# Altium schematic sheet Expansion_Board_DCDC Ver_for_MSP430.SchDoc
size A3
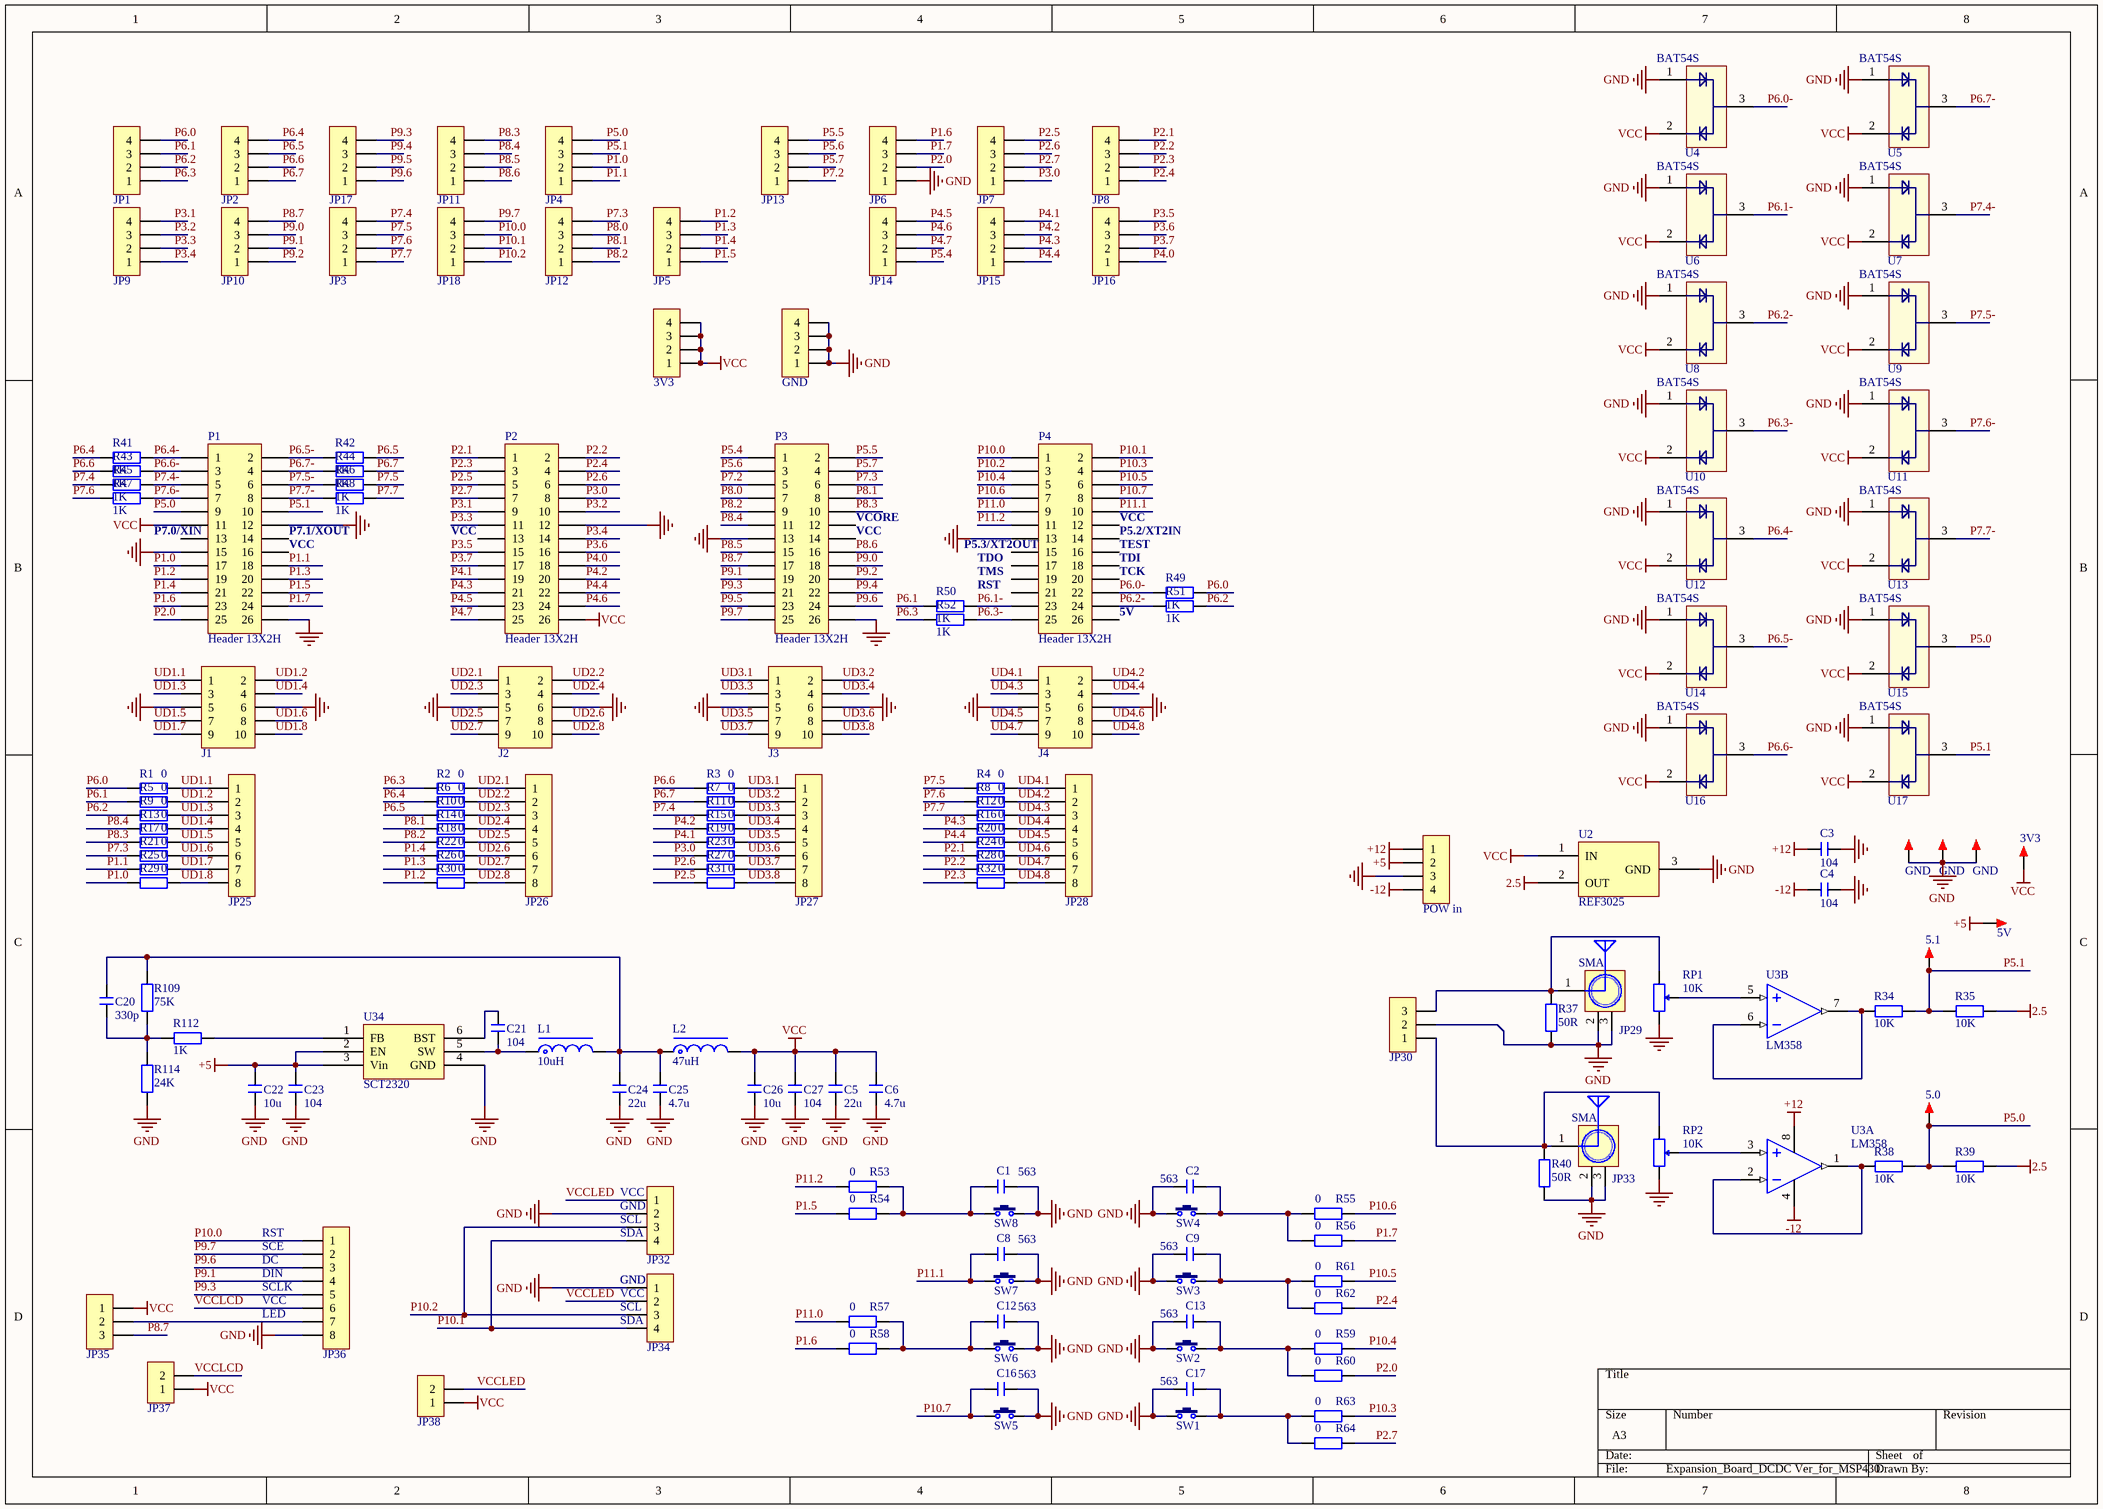
[diagram p0: Expansion_Board_DCDC Ver_for_MSP430.SchDoc]

## Parts
(Parts that share a designator on the sheet are numbered #1, #2 ... from top to bottom, then left to right.)
3V3#1  HDR-1X4  [KF2510-LI-4P]  (value not drawn)
3V3#2  3V3  [TEST 2.0]  (value not drawn)
5.0  3V3  [TEST 2.0]  (value not drawn)
5.1  3V3  [TEST 2.0]  (value not drawn)
5V  3V3  [TEST 2.0]  (value not drawn)
C1  563  [C 0603_L]
C2  563  [C 0603_L]
C3  104  [C 0805_L]
C4  104  [C 0805_L]
C5  22u  [C 1210_L]
C6  4.7u  [C 0805_L]
C8  563  [C 0603_L]
C9  563  [C 0603_L]
C12  563  [C 0603_L]
C13  563  [C 0603_L]
C16  563  [C 0603_L]
C17  563  [C 0603_L]
C20  330p  [C 0805_L]
C21  104  [C 0805_L]
C22  10u  [C 0805_L]
C23  104  [C 0805_L]
C24  22u  [C 1210_L]
C25  4.7u  [C 0805_L]
C26  10u  [C 0805_L]
C27  104  [C 0805_L]
GND#1  HDR-1X4  [KF2510-LI-4P]  (value not drawn)
GND#2  TEST TP  [TEST TP1.4_BK]  (value not drawn)
GND#3  TEST TP  [TEST TP1.4_BK]  (value not drawn)
GND#4  TEST TP  [TEST TP1.4_BK]  (value not drawn)
J1  Header 5X2  [IDC2.54-LI-2x5P]  (value not drawn)
J2  Header 5X2  [IDC2.54-LI-2x5P]  (value not drawn)
J3  Header 5X2  [IDC2.54-LI-2x5P]  (value not drawn)
J4  Header 5X2  [IDC2.54-LI-2x5P]  (value not drawn)
JP1  HDR-1X4  [KF2510-LI-4P]  (value not drawn)
JP2  HDR-1X4  [KF2510-LI-4P]  (value not drawn)
JP3  HDR-1X4  [KF2510-LI-4P]  (value not drawn)
JP4  HDR-1X4  [KF2510-LI-4P]  (value not drawn)
JP5  HDR-1X4  [KF2510-LI-4P]  (value not drawn)
JP6  HDR-1X4  [KF2510-LI-4P]  (value not drawn)
JP7  HDR-1X4  [KF2510-LI-4P]  (value not drawn)
JP8  HDR-1X4  [KF2510-LI-4P]  (value not drawn)
JP9  HDR-1X4  [KF2510-LI-4P]  (value not drawn)
JP10  HDR-1X4  [KF2510-LI-4P]  (value not drawn)
JP11  HDR-1X4  [KF2510-LI-4P]  (value not drawn)
JP12  HDR-1X4  [KF2510-LI-4P]  (value not drawn)
JP13  HDR-1X4  [KF2510-LI-4P]  (value not drawn)
JP14  HDR-1X4  [KF2510-LI-4P]  (value not drawn)
JP15  HDR-1X4  [KF2510-LI-4P]  (value not drawn)
JP16  HDR-1X4  [KF2510-LI-4P]  (value not drawn)
JP17  HDR-1X4  [KF2510-LI-4P]  (value not drawn)
JP18  HDR-1X4  [KF2510-LI-4P]  (value not drawn)
JP25  HDR-1X8  [KF2510-LI-8P]  (value not drawn)
JP26  HDR-1X8  [KF2510-LI-8P]  (value not drawn)
JP27  HDR-1X8  [KF2510-LI-8P]  (value not drawn)
JP28  HDR-1X8  [KF2510-LI-8P]  (value not drawn)
JP29  SMA  [SMA_FR]
JP30  HDR-1X3  [KF2510-LI-3P]  (value not drawn)
JP32  HDR-1X4  [HDR2.54-M-LI-4P]  (value not drawn)
JP33  SMA  [SMA_FR]
JP34  HDR-1X4  [HDR2.54-M-LI-4P]  (value not drawn)
JP35  HDR-1X3  [HDR2.54-LI-3P]  (value not drawn)
JP36  HDR-1X8  [HDR2.54-M-LI-8P]  (value not drawn)
JP37  HDR-1X2  [HDR2.54-LI-2P]  (value not drawn)
JP38  HDR-1X2  [HDR2.54-LI-2P]  (value not drawn)
L1  10uH  [CDRH74]
L2  47uH  [CDRH74]
P1  Header 13X2H  [HDR2X13]
P2  Header 13X2H  [HDR2X13]
P3  Header 13X2H  [HDR2X13]
P4  Header 13X2H  [HDR2X13]
POW_in  HDR-1X4  [KF2510-LI-4P]  (value not drawn)
R1  0  [R 0603_L]
R2  0  [R 0603_L]
R3  0  [R 0603_L]
R4  0  [R 0603_L]
R5  0  [R 0603_L]
R6  0  [R 0603_L]
R7  0  [R 0603_L]
R8  0  [R 0603_L]
R9  0  [R 0603_L]
R10  0  [R 0603_L]
R11  0  [R 0603_L]
R12  0  [R 0603_L]
R13  0  [R 0603_L]
R14  0  [R 0603_L]
R15  0  [R 0603_L]
R16  0  [R 0603_L]
R17  0  [R 0603_L]
R18  0  [R 0603_L]
R19  0  [R 0603_L]
R20  0  [R 0603_L]
R21  0  [R 0603_L]
R22  0  [R 0603_L]
R23  0  [R 0603_L]
R24  0  [R 0603_L]
R25  0  [R 0603_L]
R26  0  [R 0603_L]
R27  0  [R 0603_L]
R28  0  [R 0603_L]
R29  0  [R 0603_L]
R30  0  [R 0603_L]
R31  0  [R 0603_L]
R32  0  [R 0603_L]
R34  10K  [R 0805_L]
R35  10K  [R 0805_L]
R37  50R  [R 0805_L]
R38  10K  [R 0805_L]
R39  10K  [R 0805_L]
R40  50R  [R 0805_L]
R41  1K  [R 0603_L]
R42  1K  [R 0603_L]
R43  1K  [R 0603_L]
R44  1K  [R 0603_L]
R45  1K  [R 0603_L]
R46  1K  [R 0603_L]
R47  1K  [R 0603_L]
R48  1K  [R 0603_L]
R49  1K  [R 0603_L]
R50  1K  [R 0603_L]
R51  1K  [R 0603_L]
R52  1K  [R 0603_L]
R53  0  [R 0603_L]
R54  0  [R 0603_L]
R55  0  [R 0603_L]
R56  0  [R 0603_L]
R57  0  [R 0603_L]
R58  0  [R 0603_L]
R59  0  [R 0603_L]
R60  0  [R 0603_L]
R61  0  [R 0603_L]
R62  0  [R 0603_L]
R63  0  [R 0603_L]
R64  0  [R 0603_L]
R109  75K  [R 0805_L]
R112  1K  [R 0805_L]
R114  24K  [R 0805_L]
RP1  10K  [3296W]
RP2  10K  [3296W]
SW1  3x6x5  [TSW SMD-3*6*4.3]  (value not drawn)
SW2  3x6x5  [TSW SMD-3*6*4.3]  (value not drawn)
SW3  3x6x5  [TSW SMD-3*6*4.3]  (value not drawn)
SW4  3x6x5  [TSW SMD-3*6*4.3]  (value not drawn)
SW5  3x6x5  [TSW SMD-3*6*4.3]  (value not drawn)
SW6  3x6x5  [TSW SMD-3*6*4.3]  (value not drawn)
SW7  3x6x5  [TSW SMD-3*6*4.3]  (value not drawn)
SW8  3x6x5  [TSW SMD-3*6*4.3]  (value not drawn)
U2  REF3025  [SOT23-3L]
U3  LM358  [SOP8]  (parts A,B of 2)
U4  BAT54S  [SOT23-3L]
U5  BAT54S  [SOT23-3L]
U6  BAT54S  [SOT23-3L]
U7  BAT54S  [SOT23-3L]
U8  BAT54S  [SOT23-3L]
U9  BAT54S  [SOT23-3L]
U10  BAT54S  [SOT23-3L]
U11  BAT54S  [SOT23-3L]
U12  BAT54S  [SOT23-3L]
U13  BAT54S  [SOT23-3L]
U14  BAT54S  [SOT23-3L]
U15  BAT54S  [SOT23-3L]
U16  BAT54S  [SOT23-3L]
U17  BAT54S  [SOT23-3L]
U34  SCT2320  [SOT23-6]

## Nets
2.5: R35.1 R39.1 U2.2(OUT)
+5: 5V.1 C22.2 C23.2 POW_in.2 U34.2(EN) U34.3(Vin)
+12: C3.2 POW_in.1 U3.8(V+)
-12: C4.2 POW_in.4 U3.4(V-)
GND: C1.2 C2.2 C3.1 C4.1 C5.1 C6.1 C8.2 C9.2 C12.2 C13.2 C16.2 C17.2 C22.1 C23.1 C24.1 C25.1 C26.1 C27.1 GND#1.1 GND#1.2 GND#1.3 GND#1.4 GND#2.1 GND#3.1 GND#4.1 J1.5 J1.6 J2.5 J2.6 J3.5 J3.6 J4.5 J4.6 JP6.1 JP29.2(GND) JP29.3(GND) JP30.2 JP32.2 JP33.2(GND) JP33.3(GND) JP34.1 JP36.8 P1.12 P1.15 P1.26 P2.12 P3.13 P3.26 P4.13 POW_in.3 R37.1 R40.1 R114.1 RP1.3 RP2.3 SW1.2 SW2.2 SW3.2 SW4.2 SW5.2 SW6.2 SW7.2 SW8.2 U2.3(GND) U4.1 U5.1 U6.1 U7.1 U8.1 U9.1 U10.1 U11.1 U12.1 U13.1 U14.1 U15.1 U16.1 U17.1 U34.4(GND)
VCC: 3V3#1.1 3V3#1.2 3V3#1.3 3V3#1.4 3V3#2.1 C5.2 C6.2 C26.2 C27.2 JP35.1 JP37.1 JP38.1 L2.2 P1.11 P2.26 U2.1(IN) U4.2 U5.2 U6.2 U7.2 U8.2 U9.2 U10.2 U11.2 U12.2 U13.2 U14.2 U15.2 U16.2 U17.2
P1.0: JP4.2 P1.17 R29.1
P1.1: JP4.1 P1.18 R25.1
P1.2: JP5.4 P1.19 R30.1
P1.3: JP5.3 P1.20 R26.1
P1.4: JP5.2 P1.21 R22.1
P1.5: JP5.1 P1.22 R54.2
P1.6: JP6.4 P1.23 R58.2
P1.7: JP6.3 P1.24 R56.2
P2.0: JP6.2 P1.25 R60.2
P2.1: JP8.4 P2.1 R24.1
P2.2: JP8.3 P2.2 R28.1
P2.3: JP8.2 P2.3 R32.1
P2.4: JP8.1 P2.4 R62.2
P2.5: JP7.4 P2.5 R31.1
P2.6: JP7.3 P2.6 R27.1
P2.7: JP7.2 P2.7 R64.2
P3.0: JP7.1 P2.8 R23.1
P3.1: JP9.4 P2.9
P3.2: JP9.3 P2.10
P3.3: JP9.2 P2.11
P3.4: JP9.1 P2.14
P3.5: JP16.4 P2.15
P3.6: JP16.3 P2.16
P3.7: JP16.2 P2.17
P4.0: JP16.1 P2.18
P4.1: JP15.4 P2.19 R19.1
P4.2: JP15.3 P2.20 R15.1
P4.3: JP15.2 P2.21 R16.1
P4.4: JP15.1 P2.22 R20.1
P4.5: JP14.4 P2.23
P4.6: JP14.3 P2.24
P4.7: JP14.2 P2.25
P5.0: 5.0.1 JP4.4 P1.9 R38.1 R39.2 U15.3
P5.1: 5.1.1 JP4.3 P1.10 R34.1 R35.2 U17.3
P5.4: JP14.1 P3.1
P5.5: JP13.4 P3.2
P5.6: JP13.3 P3.3
P5.7: JP13.2 P3.4
P6.0: JP1.4 R1.1 R49.2
P6.0-: P4.22 R49.1 U4.3
P6.1: JP1.3 R5.1 R50.2
P6.1-: P4.23 R50.1 U6.3
P6.2: JP1.2 R9.1 R51.2
P6.2-: P4.24 R51.1 U8.3
P6.3: JP1.1 R2.1 R52.2
P6.3-: P4.25 R52.1 U10.3
P6.4: JP2.4 R6.1 R41.1
P6.4-: P1.1 R41.2 U12.3
P6.5: JP2.3 R10.1 R42.2
P6.5-: P1.2 R42.1 U14.3
P6.6: JP2.2 R3.1 R43.1
P6.6-: P1.3 R43.2 U16.3
P6.7: JP2.1 R7.1 R44.2
P6.7-: P1.4 R44.1 U5.3
P7.2: JP13.1 P3.5
P7.3: JP12.4 P3.6 R21.1
P7.4: JP3.4 R11.1 R45.1
P7.4-: P1.5 R45.2 U7.3
P7.5: JP3.3 R4.1 R46.2
P7.5-: P1.6 R46.1 U9.3
P7.6: JP3.2 R8.1 R47.1
P7.6-: P1.7 R47.2 U11.3
P7.7: JP3.1 R12.1 R48.2
P7.7-: P1.8 R48.1 U13.3
P8.0: JP12.3 P3.7
P8.1: JP12.2 P3.8 R14.1
P8.2: JP12.1 P3.9 R18.1
P8.3: JP11.4 P3.10 R17.1
P8.4: JP11.3 P3.11 R13.1
P8.5: JP11.2 P3.15
P8.6: JP11.1 P3.16
P8.7: JP10.4 JP35.3 P3.17
P9.0: JP10.3 P3.18
P9.1: JP10.2 JP36.4 P3.19
P9.2: JP10.1 P3.20
P9.3: JP17.4 JP36.5 P3.21
P9.4: JP17.3 P3.22
P9.5: JP17.2 P3.23
P9.6: JP17.1 JP36.3 P3.24
P9.7: JP18.4 JP36.2 P3.25
P10.0: JP18.3 JP36.1 P4.1
P10.1: JP18.2 JP32.4 JP34.4 P4.2
P10.2: JP18.1 JP32.3 JP34.3 P4.3
P10.3: P4.4 R63.2
P10.4: P4.5 R59.2
P10.5: P4.6 R61.2
P10.6: P4.7 R55.2
P10.7: C16.1 P4.8 SW5.1
P11.0: P4.9 R57.2
P11.1: C8.1 P4.10 SW7.1
P11.2: P4.11 R53.2
UD1.1: J1.1 JP25.1 R1.2
UD1.2: J1.2 JP25.2 R5.2
UD1.3: J1.3 JP25.3 R9.2
UD1.4: J1.4 JP25.4 R13.2
UD1.5: J1.7 JP25.5 R17.2
UD1.6: J1.8 JP25.6 R21.2
UD1.7: J1.9 JP25.7 R25.2
UD1.8: J1.10 JP25.8 R29.2
UD2.1: J2.1 JP26.1 R2.2
UD2.2: J2.2 JP26.2 R6.2
UD2.3: J2.3 JP26.3 R10.2
UD2.4: J2.4 JP26.4 R14.2
UD2.5: J2.7 JP26.5 R18.2
UD2.6: J2.8 JP26.6 R22.2
UD2.7: J2.9 JP26.7 R26.2
UD2.8: J2.10 JP26.8 R30.2
UD3.1: J3.1 JP27.1 R3.2
UD3.2: J3.2 JP27.2 R7.2
UD3.3: J3.3 JP27.3 R11.2
UD3.4: J3.4 JP27.4 R15.2
UD3.5: J3.7 JP27.5 R19.2
UD3.6: J3.8 JP27.6 R23.2
UD3.7: J3.9 JP27.7 R27.2
UD3.8: J3.10 JP27.8 R31.2
UD4.1: J4.1 JP28.1 R4.2
UD4.2: J4.2 JP28.2 R8.2
UD4.3: J4.3 JP28.3 R12.2
UD4.4: J4.4 JP28.4 R16.2
UD4.5: J4.7 JP28.5 R20.2
UD4.6: J4.8 JP28.6 R24.2
UD4.7: J4.9 JP28.7 R28.2
UD4.8: J4.10 JP28.8 R32.2
VCCLCD: JP36.6 JP37.2
VCCLED: JP32.1 JP34.2 JP38.2
NetC1_1: C1.1 R53.1 R54.1 SW8.1
NetC2_1: C2.1 R55.1 R56.1 SW4.1
NetC9_1: C9.1 R61.1 R62.1 SW3.1
NetC12_1: C12.1 R57.1 R58.1 SW6.1
NetC13_1: C13.1 R59.1 R60.1 SW2.1
NetC17_1: C17.1 R63.1 R64.1 SW1.1
NetC20_1: C20.1 R109.1 R112.2 R114.2
NetC20_2: C20.2 C24.2 C25.2 L1.2 L2.1 R109.2
NetC21_1: C21.1 U34.6(BST)
NetC21_2: C21.2 L1.1 U34.5(SW)
NetJP29_1: JP29.1(ANT) JP30.3 R37.2 RP1.1
NetJP30_1: JP30.1 JP33.1(ANT) R40.2 RP2.1
NetJP35_2: JP35.2 JP36.7
NetR34_2: R34.2 U3.6(IN-) U3.7(OUT)
NetR38_2: R38.2 U3.1(OUT) U3.2(IN-)
NetR112_1: R112.1 U34.1(FB)
NetRP1_2: RP1.2 U3.5(IN+)
NetRP2_2: RP2.2 U3.3(IN+)

Not connected (* = marked no-connect by the designer): P1 13 14 16; P2 13; P3 12 14; P4 12 14 15 16 17 18 19 20 21 26

## Notes on the sheet
- (near P1) P7.0/XIN <v>
- P7.1/XOUT <v>
- (near P1) VCC <v>
- (near P2) VCC <v>
- (near P3) VCORE <v>
- (near P3) VCC <v>
- (near P4) P5.3/XT2OUT <v>
- TDO <v>
- TMS <v>
- RST <v>
- (near P4) TEST <v>
- TDI <v>
- TCK <v>
- (near P4) P5.2/XT2IN <v>
- (near P4) VCC <v>
- 5V <v>
- (near JP36) RST
- (near JP36) SCE
- (near JP36) DC
- (near JP32) VCC
- (near JP32) GND
- (near JP32) SCL
- (near JP32) SDA
- (near JP36) DIN
- (near JP36) SCLK
- (near JP36) VCC
- (near JP36) LED
- (near JP34) SDA
- (near JP34) SCL
- (near JP34) VCC
- (near JP34) GND

## Library data of the parts
3V3#1 GND#1 JP1-JP18 JP32 JP34 POW_in = Header 4: 4P接插件; 淘宝ID: 小糖豆的小窝窝; BOM名称: 4P接插件; 下单链接: https://item.taobao.com/item.htm?ft=t&id=613637044352
3V3#2 5.0 5.1 5V = TEST: 测试点; 淘宝ID: 小糖豆的小窝窝; BOM名称: 测试点; 下单链接: https://item.taobao.com/item.htm?ft=t&id=613637044352
C1-C6 C8 C9 C12 C13 C16 C17 C20-C27 = C: 贴片电容; 淘宝ID: 小糖豆的小窝窝; BOM名称: 贴片电容; 下单链接: https://item.taobao.com/item.htm?ft=t&id=613637044352
GND#2-GND#4 = TEST TP: 测试环; 淘宝ID: 小糖豆的小窝窝; BOM名称: 测试环; 下单链接: https://item.taobao.com/item.htm?ft=t&id=613637044352
J1-J4 = Header 5X2: 5*2P接插件; 淘宝ID: 小糖豆的小窝窝; BOM名称: 5*2P接插件; 下单链接: https://item.taobao.com/item.htm?ft=t&id=613637044352
JP25-JP28 JP36 = Header 8: 8P接插件; 淘宝ID: 小糖豆的小窝窝; BOM名称: 8P接插件; 下单链接: https://item.taobao.com/item.htm?ft=t&id=613637044352
JP29 JP33 = SMA WIFI: SMA-2.4G射频天线接口; 淘宝ID: 小糖豆的小窝窝; BOM名称: SMA-2.4G射频天线接口; 下单链接: https://item.taobao.com/item.htm?ft=t&id=613637044352
JP30 JP35 = Header 3: 3P接插件; 淘宝ID: 小糖豆的小窝窝; BOM名称: 3P接插件; 下单链接: https://item.taobao.com/item.htm?ft=t&id=613637044352
JP37 JP38 = Header 2: 2P接插件; 淘宝ID: 小糖豆的小窝窝; BOM名称: 2P接插件; 下单链接: https://item.taobao.com/item.htm?ft=t&id=613637044352
L1 L2 = L-CDRH: 功率屏蔽电感; 淘宝ID: 小糖豆的小窝窝; BOM名称: 功率屏蔽电感; 下单链接: https://item.taobao.com/item.htm?ft=t&id=613637044352
P1-P4 = Header 13X2H: Header, 13-Pin, Dual row, Right Angle; LatestRevisionDate: 17-Jul-2002; LatestRevisionNote: Re-released for DXP Platform.; Publisher: Altium Limited
R1-R32 R34 R35 R37-R64 R109 R112 R114 = R: 贴片电阻; 淘宝ID: 小糖豆的小窝窝; BOM名称: 贴片电阻; 下单链接: https://item.taobao.com/item.htm?ft=t&id=613637044352
RP1 RP2 = RP: 单联电位器; 淘宝ID: 小糖豆的小窝窝; BOM名称: 单联电位器; 下单链接: https://item.taobao.com/item.htm?ft=t&id=613637044352
SW1-SW8 = TSW 3x6: 3x6轻触开关; 淘宝ID: 小糖豆的小窝窝; BOM名称: 3x6轻触开关; 下单链接: https://item.taobao.com/item.htm?ft=t&id=613637044352
U3 = LM358: 双运放; 淘宝ID: 小糖豆的小窝窝; Alias1: https://item.taobao.com/item.htm?ft=t&id=613637044352; BOM名称: 双运放
U34 = SCT2330